# Altium project SFH7072_Breakout.PrjPcb
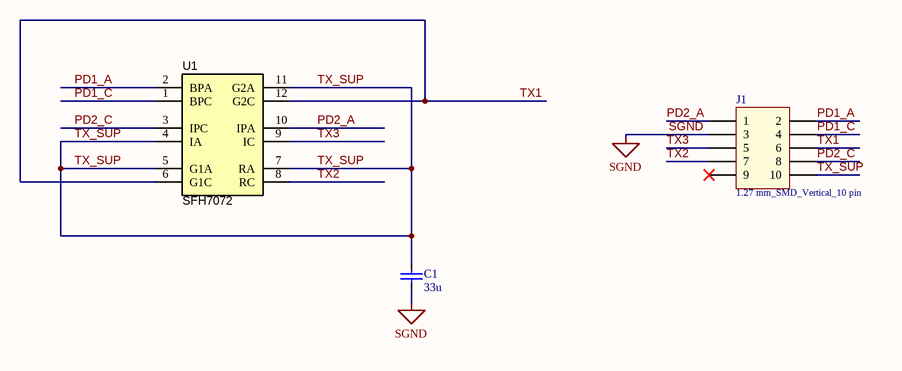
[diagram p0: SFH7072_Breakout.SchDoc]
1 sheet, 3 parts. Net scope: global (net labels, ports and power ports of the same name join across sheets).
Board file: SFH7072_Breakout.PcbDoc

## Sheet SFH7072_Breakout.SchDoc
size A4

### Parts
C1  33u  [CAPC2012X05N]
J1  1.27 mm_SMD_Vertical_10 pin  [62131021021]
U1  SFH7072  [SFH_7072]

### Nets
SGND: C1.1 J1.3
PD1_A: J1.2 U1.2(BPA)
PD1_C: J1.4 U1.1(BPC)
PD2_A: J1.1 U1.10(IPA)
PD2_C: J1.8 U1.3(IPC)
TX1: J1.6 U1.6(G1C) U1.12(G2C)
TX2: J1.7 U1.8(RC)
TX3: J1.5 U1.9(IC)
TX_SUP: C1.2 J1.10 U1.4(IA) U1.5(G1A) U1.7(RA) U1.11(G2A)

Not connected (* = marked no-connect by the designer): J1 9*

### Library data of the parts
C1 = C_33u_0805: Kondensator 10u 0402; Tested: False
J1 = 62131021021: Pin Header WR-PHD, pitch 1.27 mm, SMD, Vertical, dual row, 10 pin; Rated Current: 1 A; Pin Number: 10; Pitch: 1.27 mm; Working Voltage: 100 VAC; Contact Resistance: 20 mOhm; Insulation Resistance: >1000 MOhm; ComponentLink1Description: Manufacturer; ComponentLink1URL: http://www.we-online.de; ComponentLink2Description: Datasheet; ComponentLink2URL: http://katalog.we-online.de/em/datasheet/62131021021.pdf; Part Number: 62131021021; Published Date: Jan. 2018; Publisher: Wurth Elektronik; Operating Temperature: -40 to 105 degC; Mounting Technology: SMD; Row Number: Dual; Orientation: Vertical
U1 = SFH7072: BioMon Sensor, SMD; Manufacturer: OSRAM; SymbolCreator: Altium; SizeAreaWB_mm2: 56.05; SizeArea_mm2: 29.25; SizeX_mm: 3.9; SizeY_mm: 7.5; SizeZ_mm: 1; SymbolVersion: 2016-05-27; PartNumber: SFH7072; MountType: SMT; ComponentLink1Description: Datasheet URL; ComponentLink1URL: https://sps06.itg.ti.com/sites/KMS/crossdivteams/altium/docs/ComponentDatasheets/SFH 7072.pdf; RoHS: Y; PackageReference: 7.5x3.9mm; Publisher: Texas Instruments; LatestRevisionDate: 2016-06-03